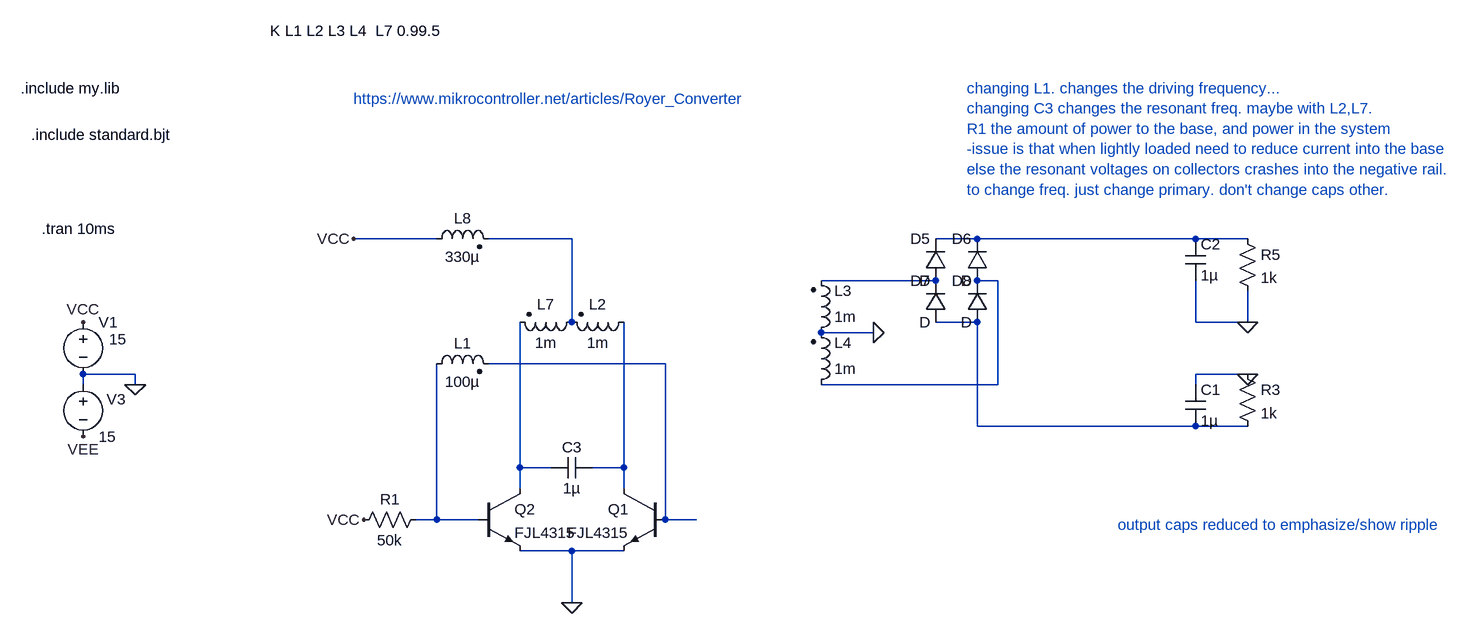
[diagram p0: schematic Draft13.asc]
Draft13.asc, the LTspice schematic file:
Version 4
SHEET 1 5720 1740
WIRE 1376 -176 1248 -176
WIRE 1584 -176 1456 -176
WIRE 2208 -176 2144 -176
WIRE 2544 -176 2208 -176
WIRE 2624 -176 2544 -176
WIRE 2144 -112 1968 -112
WIRE 2240 -112 2208 -112
WIRE 1584 -48 1584 -176
WIRE 2208 -48 2144 -48
WIRE 2544 -48 2544 -112
WIRE 2624 -48 2624 -96
WIRE 2624 -48 2544 -48
WIRE 2048 -32 1968 -32
WIRE 1728 16 1456 16
WIRE 912 32 832 32
WIRE 2624 32 2544 32
WIRE 832 48 832 32
WIRE 912 48 912 32
WIRE 2240 48 2240 -112
WIRE 2240 48 1968 48
WIRE 2544 48 2544 32
WIRE 2208 112 2208 -48
WIRE 2544 112 2208 112
WIRE 2624 112 2544 112
WIRE 1504 176 1504 -48
WIRE 1552 176 1504 176
WIRE 1664 176 1664 -48
WIRE 1664 176 1616 176
WIRE 1504 208 1504 176
WIRE 1664 208 1664 176
WIRE 1376 256 1376 16
WIRE 1376 256 1344 256
WIRE 1440 256 1376 256
WIRE 1728 256 1728 16
WIRE 1776 256 1728 256
WIRE 1584 304 1504 304
WIRE 1664 304 1584 304
WIRE 1584 384 1584 304
FLAG 2624 -48 0
FLAG 2048 -32 0
FLAG 2624 32 0
FLAG 912 48 0
FLAG 832 -48 VCC
FLAG 832 128 VEE
FLAG 1248 -176 VCC
FLAG 1584 384 0
FLAG 1264 256 VCC
SYMBOL ind2 1952 -16 M180
WINDOW 0 36 80 Left 2
WINDOW 3 36 40 Left 2
SYMATTR InstName L3
SYMATTR Value 1m
SYMATTR Type ind
SYMBOL ind2 1680 -64 R90
WINDOW 0 4 56 VBottom 2
WINDOW 3 32 56 VTop 2
SYMATTR InstName L2
SYMATTR Value 1m
SYMATTR Type ind
SYMBOL diode 2160 -112 R180
WINDOW 0 24 64 Left 2
WINDOW 3 24 0 Left 2
SYMATTR InstName D5
SYMBOL diode 2224 -112 R180
WINDOW 0 24 64 Left 2
WINDOW 3 24 0 Left 2
SYMATTR InstName D6
SYMBOL diode 2160 -48 R180
WINDOW 0 24 64 Left 2
WINDOW 3 24 0 Left 2
SYMATTR InstName D7
SYMBOL diode 2224 -48 R180
WINDOW 0 24 64 Left 2
WINDOW 3 24 0 Left 2
SYMATTR InstName D8
SYMBOL cap 2528 -176 R0
SYMATTR InstName C2
SYMATTR Value 1µ
SYMBOL res 2608 -192 R0
SYMATTR InstName R5
SYMATTR Value 1k
SYMBOL ind2 1952 64 M180
WINDOW 0 36 80 Left 2
WINDOW 3 36 40 Left 2
SYMATTR InstName L4
SYMATTR Value 1m
SYMATTR Type ind
SYMBOL cap 2528 48 R0
SYMATTR InstName C1
SYMATTR Value 1µ
SYMBOL res 2608 16 R0
SYMATTR InstName R3
SYMATTR Value 1k
SYMBOL voltage 832 -64 R0
WINDOW 123 0 0 Left 0
WINDOW 39 0 0 Left 0
WINDOW 3 40 42 Left 2
SYMATTR Value 15
SYMATTR InstName V1
SYMBOL voltage 832 32 R0
WINDOW 123 0 0 Left 0
WINDOW 39 0 0 Left 0
WINDOW 0 36 39 Left 2
SYMATTR InstName V3
SYMATTR Value 15
SYMBOL ind2 1360 32 R270
WINDOW 0 32 56 VTop 2
WINDOW 3 4 56 VBottom 2
SYMATTR InstName L1
SYMATTR Value 100µ
SYMATTR Type ind
SYMBOL ind2 1600 -64 R90
WINDOW 0 4 56 VBottom 2
WINDOW 3 32 56 VTop 2
SYMATTR InstName L7
SYMATTR Value 1m
SYMATTR Type ind
SYMBOL ind2 1360 -160 R270
WINDOW 0 32 56 VTop 2
WINDOW 3 4 56 VBottom 2
SYMATTR InstName L8
SYMATTR Value 330µ
SYMATTR Type ind
SYMBOL cap 1616 160 R90
WINDOW 0 0 32 VBottom 2
WINDOW 3 32 32 VTop 2
SYMATTR InstName C3
SYMATTR Value 1µ
SYMBOL res 1360 240 R90
WINDOW 0 0 56 VBottom 2
WINDOW 3 32 56 VTop 2
SYMATTR InstName R1
SYMATTR Value 50k
SYMBOL npn 1440 208 R0
SYMATTR InstName Q2
SYMATTR Value FJL4315
SYMBOL npn 1728 208 M0
SYMATTR InstName Q1
SYMATTR Value FJL4315
TEXT 768 -192 Left 2 !.tran 10ms
TEXT 1120 -496 Left 2 !K L1 L2 L3 L4  L7 0.99.5
TEXT 752 -336 Left 2 !.include standard.bjt
TEXT 736 -408 Left 2 !.include my.lib
TEXT 2424 264 Left 2 ;output caps reduced to emphasize/show ripple
TEXT 1248 -392 Left 2 ;https://www.mikrocontroller.net/articles/Royer_Converter
TEXT 2192 -408 Left 2 ;changing L1. changes the driving frequency...\nchanging C3 changes the resonant freq. maybe with L2,L7.\nR1 the amount of power to the base, and power in the system\n-issue is that when lightly loaded need to reduce current into the base\nelse the resonant voltages on collectors crashes into the negative rail.\nto change freq. just change primary. don't change caps other.

The netlist it stands for:
* Draft13.asc
L3 0 N003 1m
L2 N008 N001 1m
D5 N003 N002 D
D6 N004 N002 D
D7 N005 N003 D
D8 N005 N004 D
C2 N002 0 1µ
R5 N002 0 1k
L4 N004 0 1m
C1 0 N005 1µ
R3 0 N005 1k
V1 VCC 0 15
V3 0 VEE 15
L1 N009 N006 100µ
L7 N001 N007 1m
L8 VCC N001 330µ
C3 N008 N007 1µ
R1 N009 VCC 50k
Q2 N007 N009 0 0 FJL4315
Q1 N008 N006 0 0 FJL4315
.model D D
.lib standard.dio
.model NPN NPN
.model PNP PNP
.lib standard.bjt
.tran 10ms
K L1 L2 L3 L4  L7 0.99.5
.include standard.bjt
.include my.lib
* output caps reduced to emphasize/show ripple
* https://www.mikrocontroller.net/articles/Royer_Converter
* changing L1. changes the driving frequency...
* changing C3 changes the resonant freq. maybe with L2,L7.
* R1 the amount of power to the base, and power in the system
* -issue is that when lightly loaded need to reduce current into the base
* else the resonant voltages on collectors crashes into the negative rail.
* to change freq. just change primary. don't change caps other.
.backanno
.end